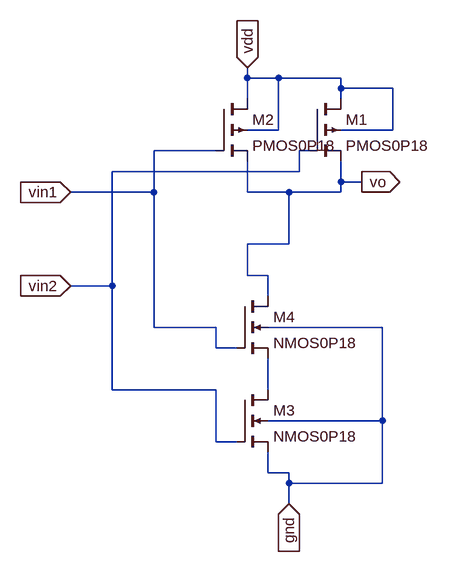
[diagram p0: schematic nand.asc]
nand.asc, the LTspice schematic file:
Version 4.1
SHEET 1 880 712
WIRE 160 -48 160 -64
WIRE 208 -48 160 -48
WIRE 304 -48 208 -48
WIRE 304 -32 304 -48
WIRE 384 -32 304 -32
WIRE 160 -16 160 -48
WIRE 304 -16 304 -32
WIRE 208 32 208 -48
WIRE 208 32 160 32
WIRE 384 32 384 -32
WIRE 384 32 304 32
WIRE 112 64 16 64
WIRE 256 64 240 64
WIRE 240 96 240 64
WIRE 240 96 -48 96
WIRE 304 112 304 80
WIRE 336 112 304 112
WIRE 16 128 16 64
WIRE 16 128 -112 128
WIRE 160 128 160 80
WIRE 224 128 160 128
WIRE 304 128 304 112
WIRE 304 128 224 128
WIRE 224 208 224 128
WIRE 224 208 160 208
WIRE 160 256 160 208
WIRE 192 256 160 256
WIRE -48 272 -48 96
WIRE -48 272 -112 272
WIRE 192 288 192 256
WIRE 16 336 16 128
WIRE 112 336 16 336
WIRE 368 336 192 336
WIRE 112 368 112 336
WIRE 144 368 112 368
WIRE -48 432 -48 272
WIRE 112 432 -48 432
WIRE 192 432 192 384
WIRE 368 480 368 336
WIRE 368 480 192 480
WIRE 112 512 112 432
WIRE 144 512 112 512
WIRE 192 560 192 528
WIRE 224 560 192 560
WIRE 224 576 224 560
WIRE 368 576 368 480
WIRE 368 576 224 576
WIRE 224 608 224 576
FLAG -112 128 vin1
IOPIN -112 128 In
FLAG 336 112 vo
IOPIN 336 112 Out
FLAG 160 -64 vdd
IOPIN 160 -64 In
FLAG 224 608 gnd
IOPIN 224 608 In
FLAG -112 272 vin2
IOPIN -112 272 In
SYMBOL pmos4 112 -16 R0
SYMATTR InstName M2
SYMATTR Value PMOS0P18
SYMATTR Value2 l=0.18u w=1.8u
SYMBOL nmos4 144 432 R0
SYMATTR InstName M3
SYMATTR Value NMOS0P18
SYMATTR Value2 l=0.18u w=1.8u
SYMBOL nmos4 144 288 R0
SYMATTR InstName M4
SYMATTR Value NMOS0P18
SYMATTR Value2 l=0.18u w=1.8u
SYMBOL pmos4 256 -16 R0
SYMATTR InstName M1
SYMATTR Value PMOS0P18
SYMATTR Value2 l=0.18u w=1.8u

The netlist it stands for:
* nand.asc
M2 vdd vin1 vo vdd PMOS0P18 l=0.18u w=1.8u
M3 N001 vin2 gnd gnd NMOS0P18 l=0.18u w=1.8u
M4 vo vin1 N001 gnd NMOS0P18 l=0.18u w=1.8u
M1 vdd vin2 vo vdd PMOS0P18 l=0.18u w=1.8u
.model NMOS NMOS
.model PMOS PMOS
.lib standard.mos
.backanno
.end